# Altium project Tutorial_PWR_REG_LED.PrjPcb
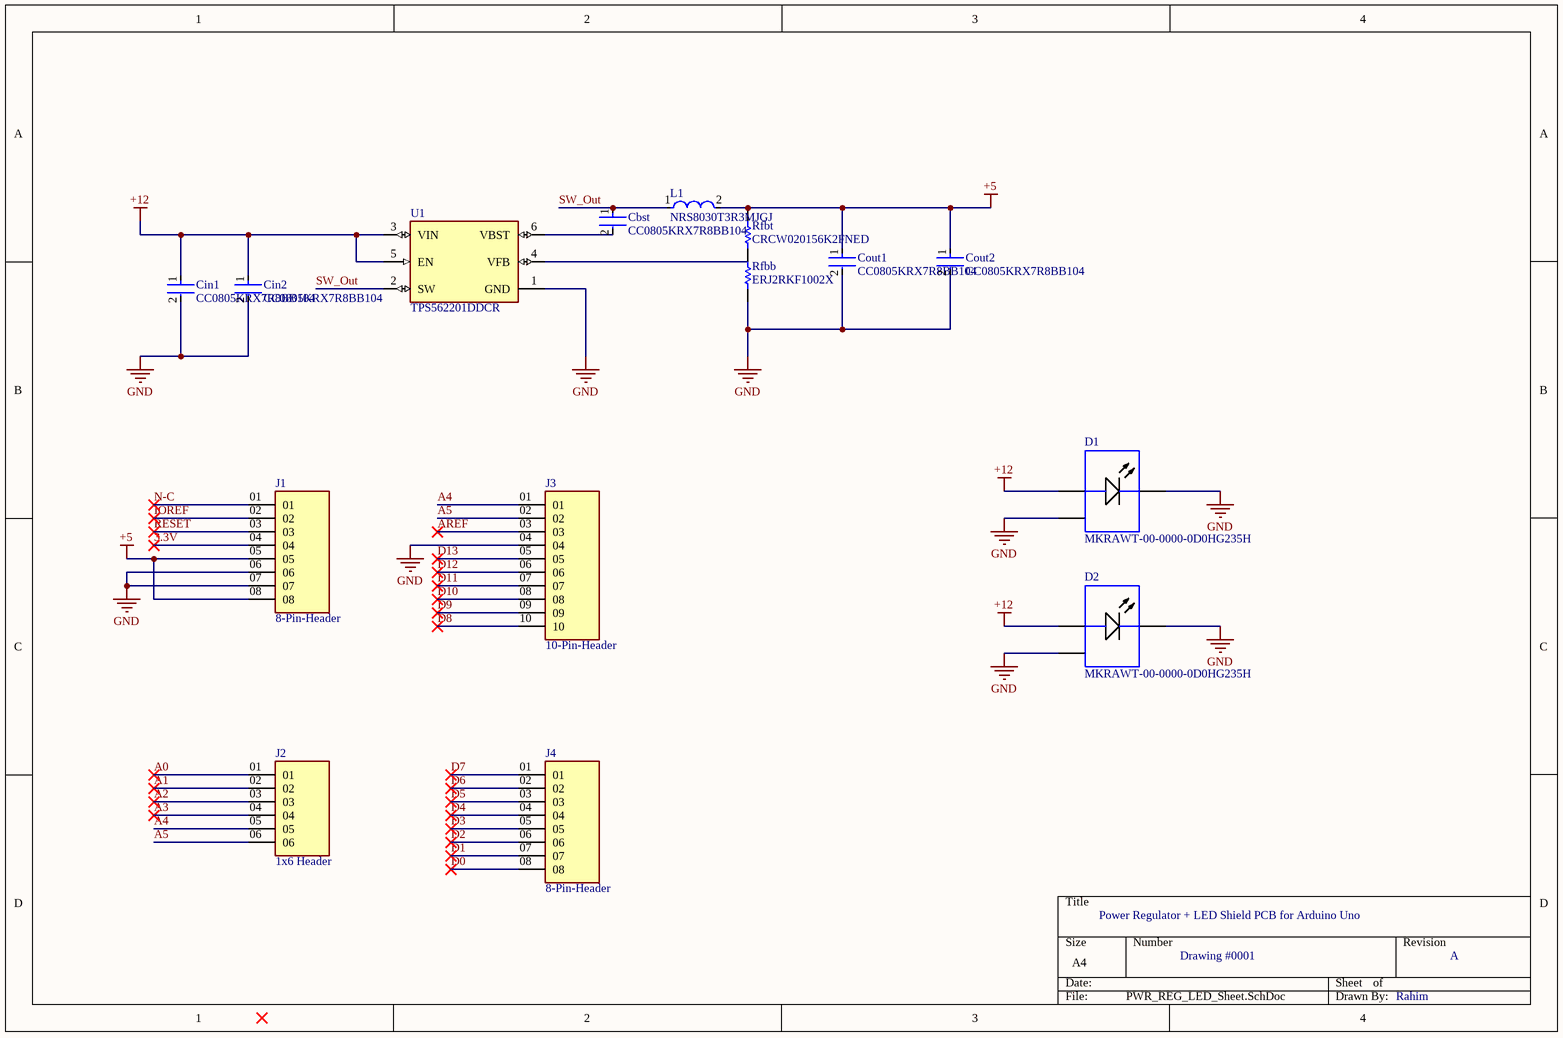
[diagram p0: PWR_REG_LED_Sheet.SchDoc]
1 sheet, 15 parts. Net scope: global (net labels, ports and power ports of the same name join across sheets).
Board file: PWR_REG_LED_PCB.PcbDoc

## Sheet PWR_REG_LED_Sheet.SchDoc
size A4; SheetNumber: 1; SheetTotal: 1

### Parts
Cbst  CC0805KRX7R8BB104  [FP-CC0805-0_85-MFG]
Cin1  CC0805KRX7R8BB104  [FP-CC0805-0_85-MFG]
Cin2  CC0805KRX7R8BB104  [FP-CC0805-0_85-MFG]
Cout1  CC0805KRX7R8BB104  [FP-CC0805-0_85-MFG]
Cout2  CC0805KRX7R8BB104  [FP-CC0805-0_85-MFG]
D1  MKRAWT-00-0000-0D0HG235H  [CREE-MK-R-2_V]
D2  MKRAWT-00-0000-0D0HG235H  [CREE-MK-R-2_V]
J1  8-Pin-Header  [SAMTEC_SSQ-108-03-X-S]
J2  1x6 Header  [SAMTEC_SSQ-106-03-X-S]
J3  10-Pin-Header  [SAMTEC_SSQ-110-03-X-S]
J4  8-Pin-Header  [SAMTEC_SSQ-108-03-X-S]
L1  NRS8030T3R3MJGJ  [FP-NRS8030-MFG]
Rfbb  ERJ2RKF1002X  [RESC1005X40X25LL05T05]
Rfbt  CRCW020156K2FNED  [RESC0603X28X15NL05T05]
U1  TPS562201DDCR  [FP-DDC0006A-IPC_C]

### Nets
+5: Cout1.1 Cout2.1 J1.05 J1.08 L1.2 Rfbt.2
+12: Cin1.1 Cin2.1 D1.1(A) D2.1(A) U1.3(VIN) U1.5(EN)
GND: Cin1.2 Cin2.2 Cout1.2 Cout2.2 D1.2(K) D1.3(EP) D2.2(K) D2.3(EP) J1.06 J1.07 J3.04 Rfbb.1 U1.1(GND)
3.3V: J1.04
A0: J2.01
A1: J2.02
A2: J2.03
A3: J2.04
A4: J2.05 J3.01
A5: J2.06 J3.02
AREF: J3.03
D0: J4.08
D1: J4.07
D2: J4.06
D3: J4.05
D4: J4.04
D5: J4.03
D6: J4.02
D7: J4.01
D8: J3.10
D9: J3.09
D10: J3.08
D11: J3.07
D12: J3.06
D13: J3.05
IOREF: J1.02
N-C: J1.01
RESET: J1.03
SW_Out: Cbst.1 L1.1 U1.2(SW)
NetCbst_2: Cbst.2 U1.6(VBST)
NetRfbt_1: Rfbt.1 U1.4(VFB)

Not connected (* = marked no-connect by the designer): Rfbb 2

### Notes on the sheet
- Power Regulator + LED Shield PCB for Arduino Uno
- Drawing #0001
- A
- Rahim

### Library data of the parts
Cbst Cin1 Cin2 Cout1 Cout2 = CMP-1036-04410-2: CAP CER 0.1UF 25V X7R 0805; Manufacturer: Yageo; Tolerance: 0.1; Value: 100 nF; ComponentLink2URL: http://www.yageo.com/documents/recent/UPY-GPHC_Y5V_6.3V-to-50V_8.pdf; Category: Cap; Mouser Description: Multilayer Ceramic Capacitors MLCC - SMD/SMT 100nF 25V X7R 10%; Manufacturer Part Number: CC0805KRX7R8BB104; Device Class L1: Passive Components; Footprint Url: http://www.yageo.com/exep/pages/download/literatures/UPY-C_GEN_24.pdf; Height: 0.95mm; Material: Ceramic; Digikey Description: CAP CER 0.1UF 25V X7R 0805; Lead Free: Yes; Temperature Range High: +85°C; Temperature: -30°C to +85°C; Ipc Land Pattern Name: CAPC200125X85; Capacitance: 100 nF; Automotive: No; Octopart: https://octopart.com/cc0805krx7r8bb104-yageo-39467766; Device Class L2: Capacitors; Temperature Characteristic: X7R; Voltage Rating: 25 V; ComponentLink2Description: Datasheet; Temperature Range Low: -30°C; Device Class L3: Ceramic Capacitors; RoHS: TRUE; Package: CC0805-0.85
D1 D2 = CMP-2100-00977-1: LED, White, 12 V, 2-Pin SMD, RoHS, Tape and Reel
J1 J4 = SSQ-108-03-X-S: 8 Position Receptacle Connector Through Hole, Right Angle; MF: Samtec; MP: SSQ-108-03-L-S; Price: None; Purchase-URL: https://pricing.snapeda.com/search/part/SSQ-108-03-L-S/?ref=eda; Value: *; Check_prices: https://www.snapeda.com/parts/SSQ-108-03-L-S/Samtec/view-part/3352745/?ref=eda; Package: None; SnapEDA_Link: https://www.snapeda.com/parts/SSQ-108-03-L-S/Samtec/view-part/3352745/?ref=snap; Availability: Bad
J2 = SSQ-106-03-X-S: 6 Position Receptacle Connector Through Hole; MP: SSQ-106-03-L-S; MF: Samtec; Value: *; SnapEDA_Link: https://www.snapeda.com/parts/SSQ-106-03-L-S/Samtec/view-part/3331053/?ref=snap; Package: None; Availability: Bad; Check_prices: https://www.snapeda.com/parts/SSQ-106-03-L-S/Samtec/view-part/3331053/?ref=eda; Price: None; Purchase-URL: https://pricing.snapeda.com/search/part/SSQ-106-03-L-S/?ref=eda
J3 = SSQ-110-03-X-S: 10 Position Receptacle Connector Through Hole, Right Angle; MF: Samtec; MP: SSQ-110-03-L-S; Purchase-URL: https://pricing.snapeda.com/search/part/SSQ-110-03-L-S/?ref=eda; Value: *; SnapEDA_Link: https://www.snapeda.com/parts/SSQ-110-03-L-S/Samtec/view-part/3589021/?ref=snap; Package: None; Availability: Bad; Price: None; Check_prices: https://www.snapeda.com/parts/SSQ-110-03-L-S/Samtec/view-part/3589021/?ref=eda
L1 = CMP-14484-000405-1: Inductor Power Shielded Wirewound 3.3uH 20% 100KHz Ferrite 4.2A 24.7mΩ DCR T/R; Current Rating: 4.3A; DC Resistance (DCR): 19mR; Self Resonant Frequency: 50MHz; Height: 3mm; Lead Free: Lead Free; Saturation Current: 4.2A; Termination: SMD/SMT; RoHS Compliant: Yes; Resistor Type: Wirewound; RMS Current (Irms): 4.3A; Series: NRS; Halogen Free: Halogen Free; Shielding: Shielded; Length: 8mm; Max DC Current: 4.2A; Height - Seated (Max): 0.118inch; Radiation Hardening: No; Min Operating Temperature: -25°C; Number of Pins: 2; Core Material: Ferrite; Inductance: 3.3uH; Package Quantity: 1000; REACH SVHC: No SVHC; Test Frequency: 100kHz; Tolerance: 20%; Case/Package: Nonstandard; Inductance Tolerance: 20%; Width: 0.315inch; Mount: Surface Mount; Depth: 8.2mm; Lead Pitch: 5.6mm; Packaging: Tape and Reel; Max Operating Temperature: 125°C
Rfbb = CMP-2000-07588-1: Chip Resistor, 10 KOhm, +/- 1%, 0.1 W, -55 to 155 degC, 0402 (1005 Metric), RoHS, Tape and Reel; Manufacturer: Panasonic; Power Rating: 100mW; Voltage Rating: 50V; Resistance: 10KOhm; Case\/Package: 0402; Temperature Coefficient: 100ppm\/degreesC; RoHSCompliant: True; Lead Free: LeadFree; Package Quantity: 1; Contact Plating: Tin; Length: 1mm; Radiation Hardening: No; REACH SVHC: NoSVHC; Max Operating Temperature: 155degC; Depth: 0.5mm; Case Code (Imperial): 0402; Military Standard: Not; Package Description: 2-Pin Surface Mount Device, Body 1 x 0.5 mm; Termination: SMD/SMT; Case Code (Metric): 1005; Height: 0.35mm; Packaging: TapeandReel; Voltage Rating (DC): 50V; Package Reference: 402; Number of Pins: 2; Tolerance: 1%; Mounting Technology: SurfaceMount; Width: 0.02inch; Mount: SurfaceMount; Datasheet URL: https://industrial.panasonic.com/cdbs/www-data/pdf/RDA0000/AOA0000C304.pdf; Composition: ThickFilm; Datasheet Version: 02/2017; Manufacturer URL: http://www.panasonic.com/; Max Power Dissipation: 100mW; Number of Terminations: 2; Min Operating Temperature: -55degC
Rfbt = CMP-2004-00723-1: Manufacturer: Vishay Dale; Part Number: CRCW020156K2FNED
U1 = CMP-04918-000361-1: IC REG BUCK ADJ 2A TSOT23-6; Switching Frequency: 580kHz; Max Input Voltage: 17V; Number of Outputs: 1; Output Voltage: 7V; Output Type: Adjustable; Quiescent Current: 400uA; Min Input Voltage: 4.5V; Mount: Surface Mount; Max Operating Temperature: 125°C; Lead Free: Lead Free; Operating Supply Voltage: 17V; Number of Pins: 6; RoHS Compliant: Yes; Contact Plating: Tin; Min Operating Temperature: -40°C; Case/Package: SOT; Max Output Current: 2A